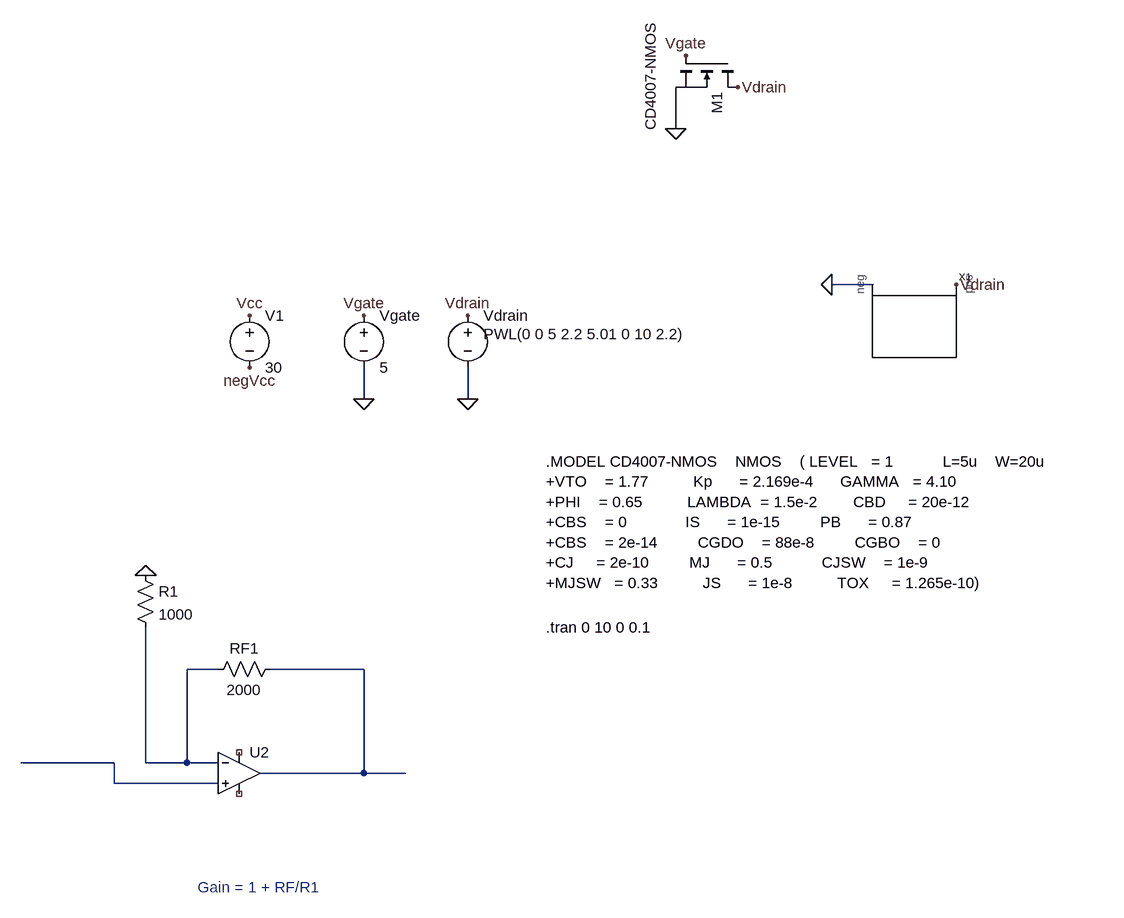
[diagram p0: schematic Draft4.asc]
Draft4.asc, the LTspice schematic file:
Version 4
SHEET 1 1280 1136
WIRE -208 -48 -208 -112
WIRE 96 192 32 192
WIRE -688 368 -688 320
WIRE -528 368 -528 320
WIRE -912 784 -960 784
WIRE -688 784 -832 784
WIRE -1072 928 -1216 928
WIRE -1024 928 -1024 720
WIRE -960 928 -960 784
WIRE -960 928 -1024 928
WIRE -912 928 -960 928
WIRE -688 944 -688 784
WIRE -688 944 -848 944
WIRE -624 944 -688 944
WIRE -1072 960 -1072 928
WIRE -912 960 -1072 960
FLAG 32 192 0
FLAG -528 368 0
FLAG -688 368 0
FLAG -688 240 Vgate
FLAG -528 240 Vdrain
FLAG -112 -112 Vdrain
FLAG -192 -160 Vgate
FLAG -208 -48 0
FLAG -1024 640 0
FLAG -864 240 Vcc
FLAG -864 320 negVcc
FLAG 224 192 Vdrain
SYMBOL solarpanelsymbol 160 256 R0
SYMATTR InstName X1
SYMBOL voltage -688 224 R0
WINDOW 123 0 0 Left 0
WINDOW 39 0 0 Left 0
SYMATTR InstName Vgate
SYMATTR Value 5
SYMBOL voltage -528 224 R0
WINDOW 3 24 44 Left 2
WINDOW 123 0 0 Left 0
WINDOW 39 0 0 Left 0
SYMATTR Value PWL(0 0 5 2.2 5.01 0 10 2.2)
SYMATTR InstName Vdrain
SYMBOL nmos -112 -160 R90
WINDOW 3 -54 135 Left 2
SYMATTR Value CD4007-NMOS
SYMATTR InstName M1
SYMBOL res -816 768 R90
WINDOW 0 0 56 VBottom 2
WINDOW 3 32 56 VTop 2
SYMATTR InstName RF1
SYMATTR Value 2000
SYMBOL OpAmps\\UniversalOpAmp -880 944 R0
SYMATTR InstName U2
SYMBOL res -1040 624 R0
SYMATTR InstName R1
SYMATTR Value 1000
SYMBOL voltage -864 224 R0
WINDOW 123 0 0 Left 0
WINDOW 39 0 0 Left 0
SYMATTR InstName V1
SYMATTR Value 30
TEXT -408 464 Left 2 !.MODEL CD4007-NMOS    NMOS    ( LEVEL   = 1           L=5u    W=20u             \n+VTO    = 1.77          Kp      = 2.169e-4      GAMMA   = 4.10  \n+PHI    = 0.65          LAMBDA  = 1.5e-2        CBD     = 20e-12\n+CBS    = 0             IS      = 1e-15         PB      = 0.87\n+CBS    = 2e-14         CGDO    = 88e-8         CGBO    = 0\n+CJ     = 2e-10         MJ      = 0.5           CJSW    = 1e-9\n+MJSW   = 0.33          JS      = 1e-8          TOX     = 1.265e-10)
TEXT -408 720 Left 2 !.tran 0 10 0 0.1
TEXT -944 1120 Left 2 ;Gain = 1 + RF/R1

The netlist it stands for:
* Draft4.asc
XX1 Vdrain 0 solarpanelsymbol  ; pins pos neg
Vgate Vgate 0 5
Vdrain Vdrain 0 PWL(0 0 5 2.2 5.01 0 10 2.2)
M1 Vdrain Vgate 0 0 CD4007-NMOS
RF1 N002 N001 2000
XU2 N003 N001 NC_01 NC_02 N002 level1 Avol=1Meg GBW=10Meg Vos=0 En=0 Enk=0 In=0 Ink=0 Rin=500Meg  ; pins In+ In- V+ V- OUT
R1 0 N001 1000
V1 Vcc negVcc 30
.model NMOS NMOS
.model PMOS PMOS
.lib standard.mos
.MODEL CD4007-NMOS    NMOS    ( LEVEL   = 1           L=5u    W=20u
+VTO    = 1.77          Kp      = 2.169e-4      GAMMA   = 4.10
+PHI    = 0.65          LAMBDA  = 1.5e-2        CBD     = 20e-12
+CBS    = 0             IS      = 1e-15         PB      = 0.87
+CBS    = 2e-14         CGDO    = 88e-8         CGBO    = 0
+CJ     = 2e-10         MJ      = 0.5           CJSW    = 1e-9
+MJSW   = 0.33          JS      = 1e-8          TOX     = 1.265e-10)
.tran 0 10 0 0.1
* Gain = 1 + RF/R1
.lib UniversalOpAmp1.lib
.backanno
.end